# EAGLE design Pcon (EAGLE 7.7.0)
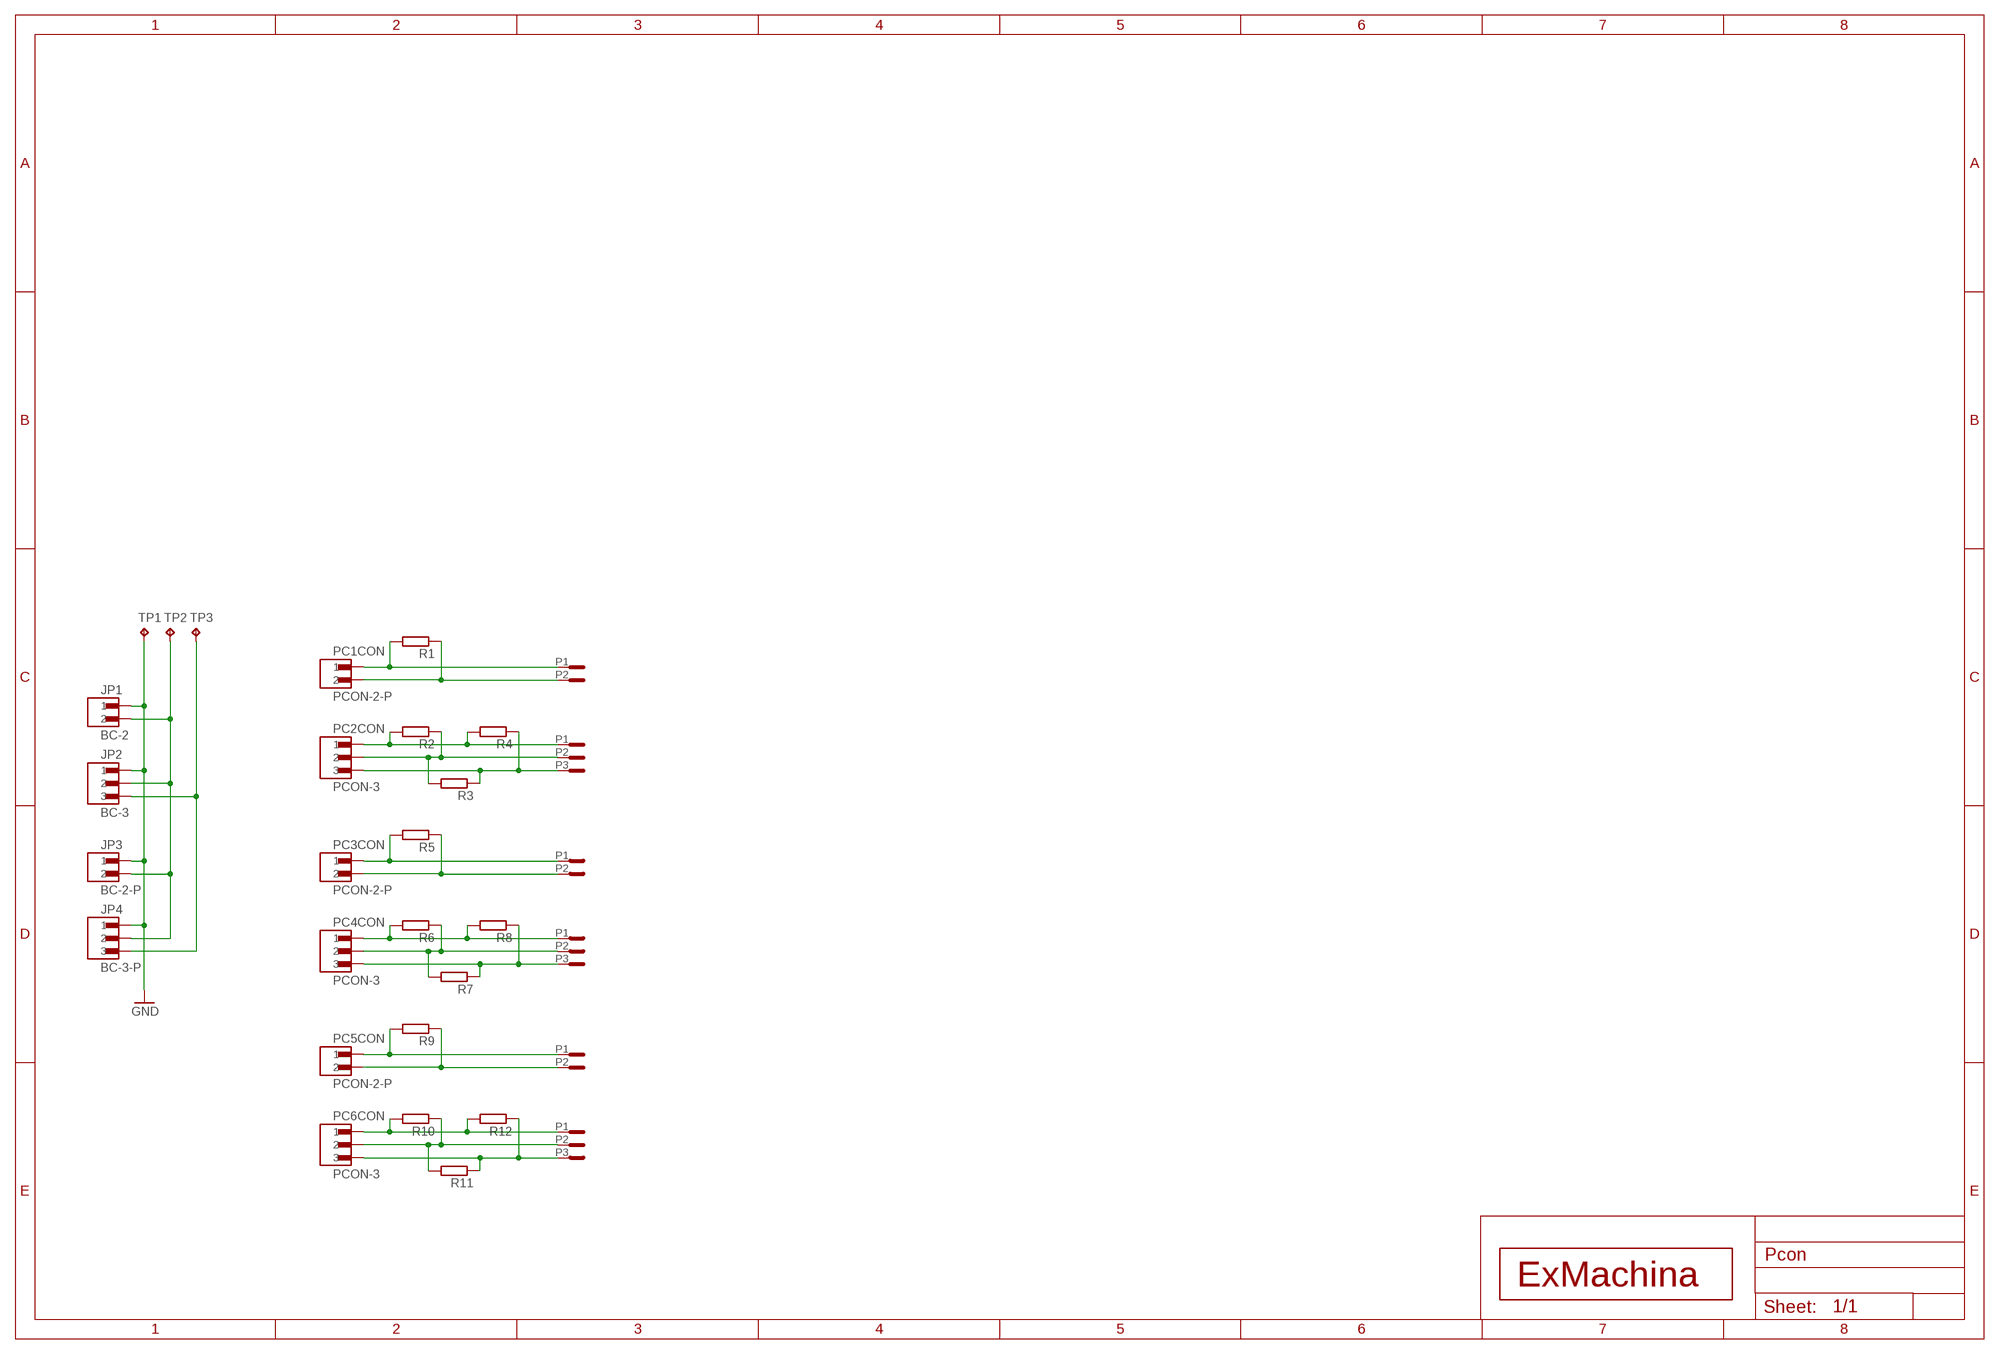
[diagram p0: schematic, sheet 1]

## Parts
JP1  BC-2  [BC-2]
JP2  BC-3  [BC-3]
JP3  BC-2-P  [BC-2-P]
JP4  BC-3-P  [BC-3-P]
PC1  PCON-2-P  [PCON-2]
PC2  PCON-3  [PCON-3]
PC3  PCON-2-P  [PCON-2]
PC4  PCON-3  [PCON-3]
PC5  PCON-2-P  [PCON-2]
PC6  PCON-3  [PCON-3]
R1  R-EU_R0603  [R0603]
R2  R-EU_R0603  [R0603]
R3  R-EU_R0603  [R0603]
R4  R-EU_R0603  [R0603]
R5  R-EU_R0603  [R0603]
R6  R-EU_R0603  [R0603]
R7  R-EU_R0603  [R0603]
R8  R-EU_R0603  [R0603]
R9  R-EU_R0603  [R0603]
R10  R-EU_R0603  [R0603]
R11  R-EU_R0603  [R0603]
R12  R-EU_R0603  [R0603]
TP1  TPB1,27  [B1,27]
TP2  TPB1,27  [B1,27]
TP3  TPB1,27  [B1,27]
U$1  EXMACHINA-LOGO  [EXM-LOGO]

## Nets
GND: JP1.1 JP2.1 JP3.1 JP4.1 TP1.TP
N$1: PC1.2 PC1.P2(P) R1.1
N$2: PC1.1 PC1.P1(P) R1.2
N$3: PC2.3 PC2.P3(P3:P) R3.1 R4.1
N$4: PC2.2 PC2.P2(P2:P) R2.1 R3.2
N$5: PC2.1 PC2.P1(P1:P) R2.2 R4.2
N$6: JP1.2 JP2.2 JP3.2 JP4.2 TP2.TP
N$7: JP2.3 JP4.3 TP3.TP
N$9: PC3.2 PC3.P2(P) R5.1
N$10: PC3.1 PC3.P1(P) R5.2
N$11: PC4.3 PC4.P3(P3:P) R7.1 R8.1
N$12: PC4.2 PC4.P2(P2:P) R6.1 R7.2
N$13: PC4.1 PC4.P1(P1:P) R6.2 R8.2
N$14: PC5.2 PC5.P2(P) R9.1
N$15: PC5.1 PC5.P1(P) R9.2
N$16: PC6.3 PC6.P3(P3:P) R11.1 R12.1
N$17: PC6.2 PC6.P2(P2:P) R10.1 R11.2
N$18: PC6.1 PC6.P1(P1:P) R10.2 R12.2

## Library data of the parts
JP1 JP3 = exmachina:BC-2?
JP2 JP4 = exmachina:BC-3?
PC1 PC3 PC5 = exmachina:PCON-2?
PC2 PC4 PC6 = exmachina:PCON-3?
R1-R12 = rcl:R-EU_: RESISTOR, European symbol
TP1-TP3 = testpad:TP: Test pad
U$1 = exmachina:EXMACHINA-LOGO

## Board
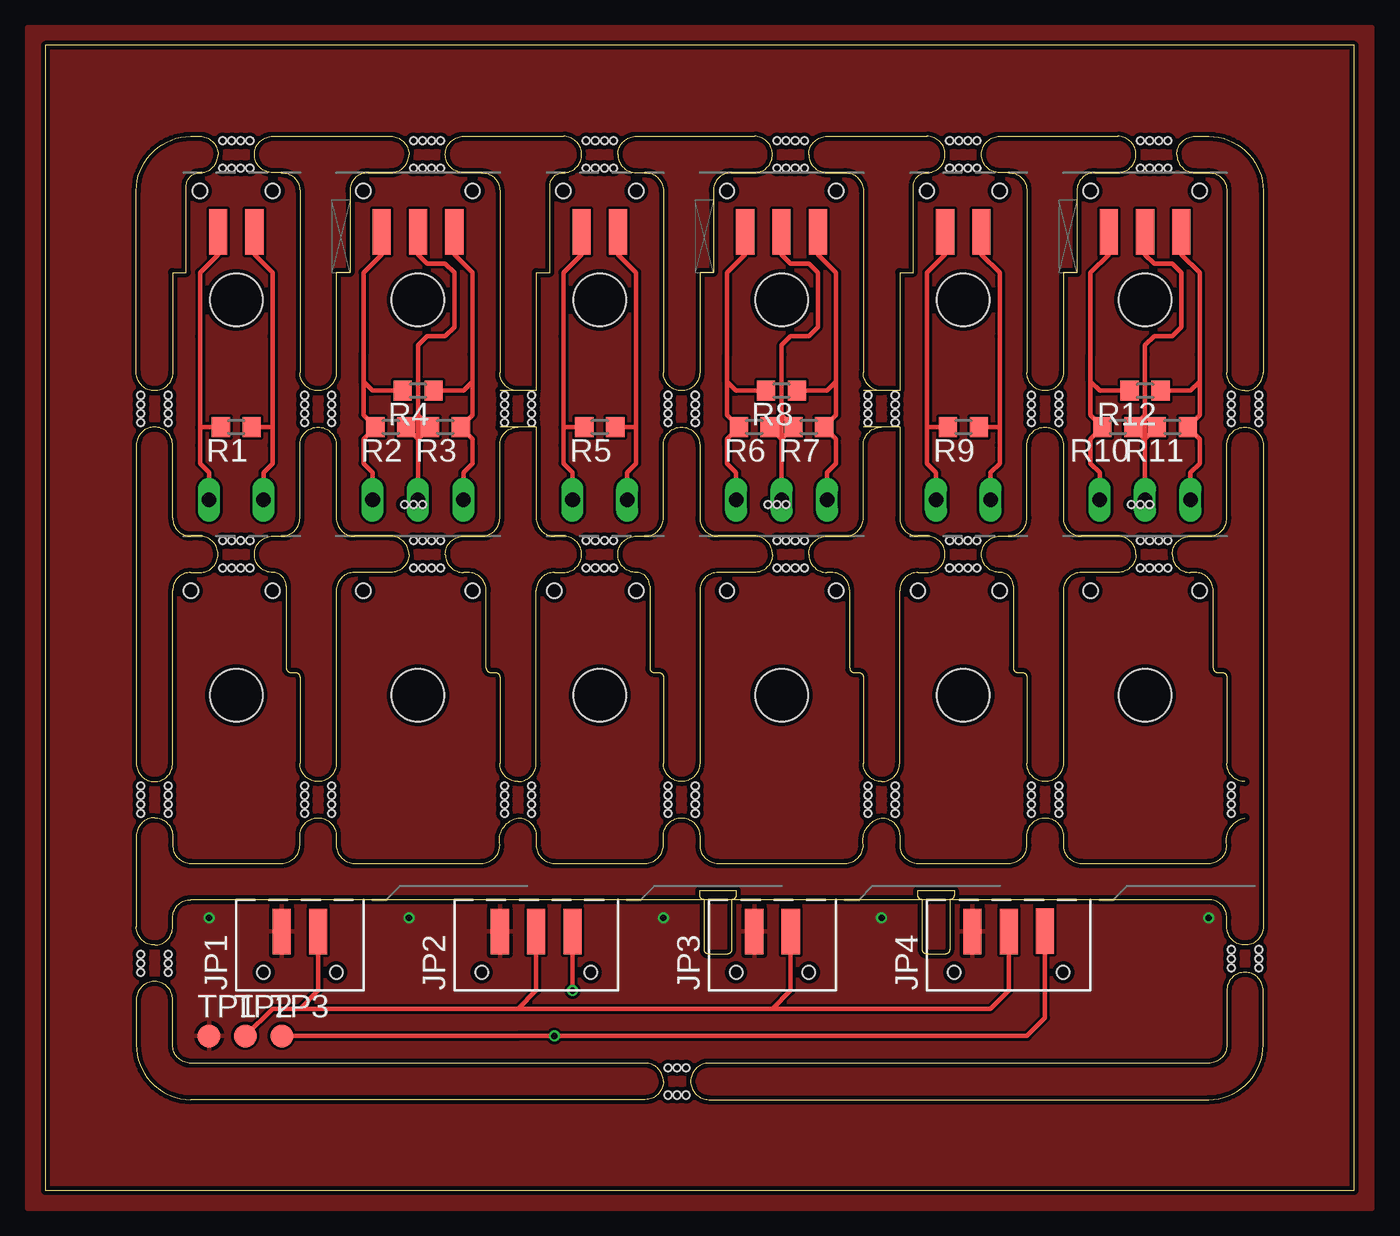
[diagram p1: board, top side]
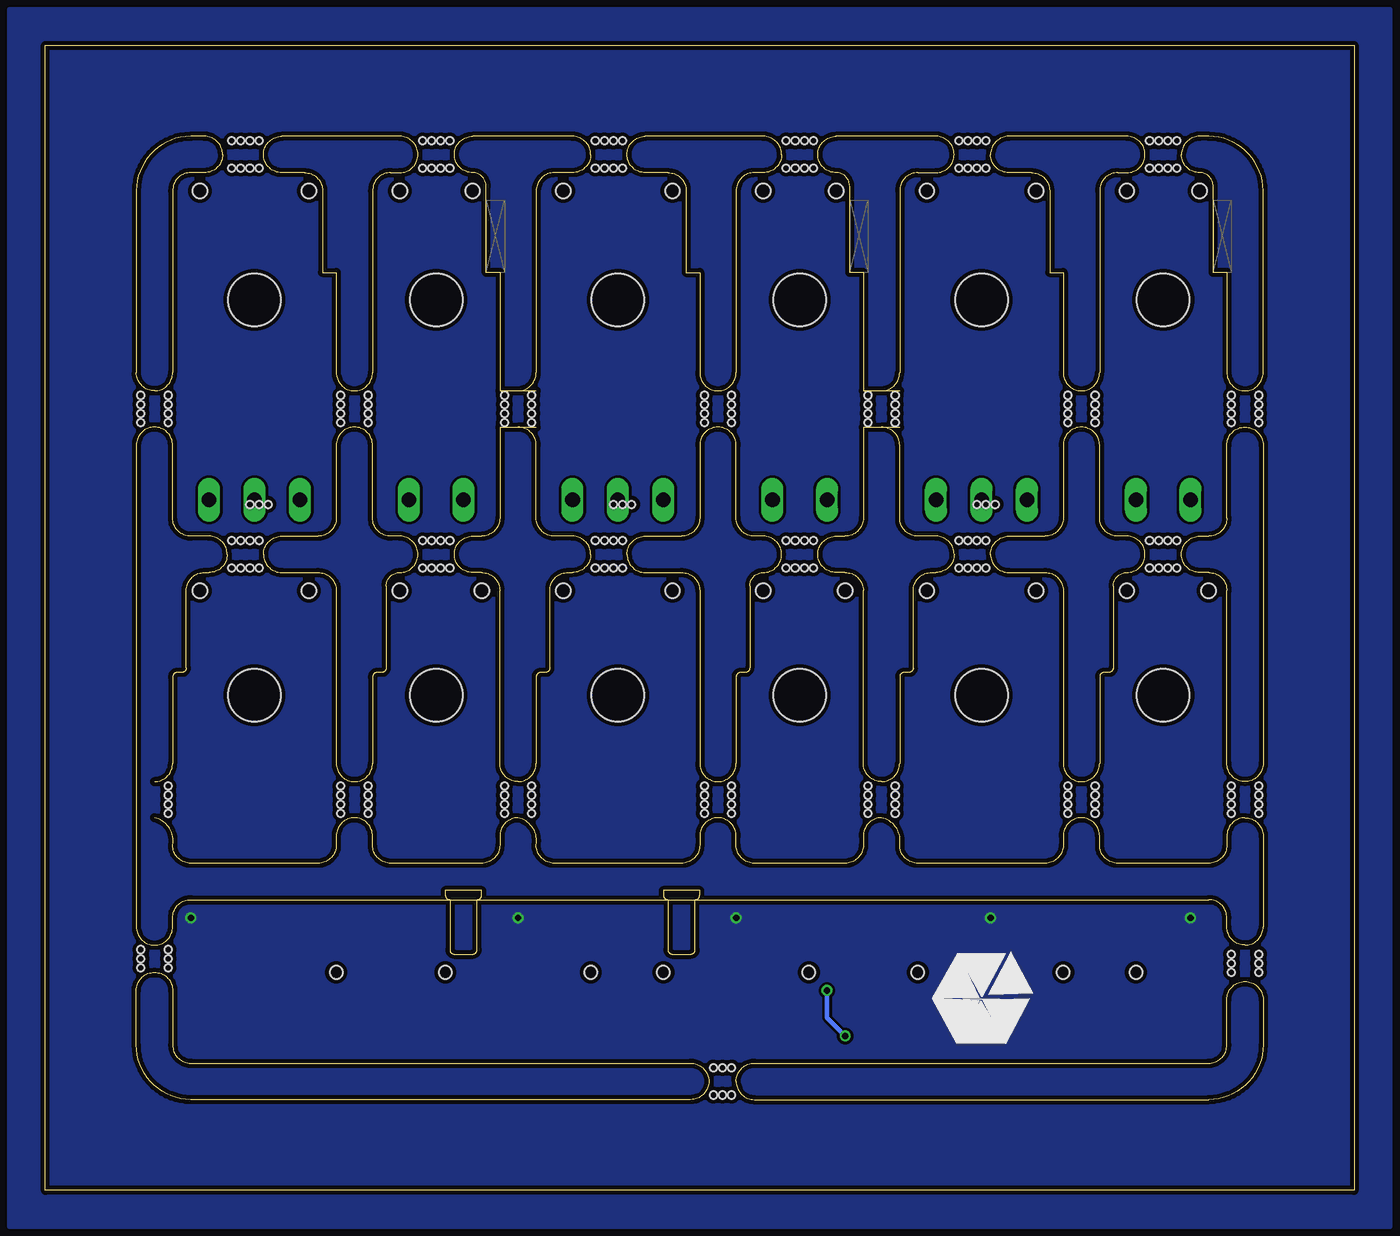
[diagram p2: board, bottom side, seen from below]

Size 72 x 63 mm. Coordinates in mm from the lower left corner, seen from the top.
Outline: 26,42 arc90 25,41 25,37 arc-90 24,36 23,36 arc90 22,35 arc90 23,34 23.25,34 arc-90 24.25,33 24.25,28.75 arc90 24.5,28.5 24.75,28.5 arc-90 25,28.25 25,23.5 arc90 26,22.5 arc90 27,23.5 27,33 arc-90 28,34 28.5,34 arc90 29.5,35 arc90 28.5,36 28,36 arc-90 27,37 27,42 25,42
Outline: 26,44 arc-90 25,45 25,55 arc90 24,56 23,56 arc-90 22,57 arc-90 23,58 28.5,58 arc-90 29.5,57 arc-90 28.5,56 arc90 27.75,55.25 27.75,50.5 27,50.5 27,44 25,44
Outline: 46,42 arc90 45,41 45,37 arc-90 44,36 43,36 arc90 42,35 arc90 43,34 43.25,34 arc-90 44.25,33 44.25,28.75 arc90 44.5,28.5 44.75,28.5 arc-90 45,28.25 45,23.5 arc90 46,22.5 arc90 47,23.5 47,33 arc-90 48,34 48.5,34 arc90 49.5,35 arc90 48.5,36 48,36 arc-90 47,37 47,42 45,42
Outline: 46,44 arc-90 45,45 45,55 arc90 44,56 43,56 arc-90 42,57 arc-90 43,58 48.5,58 arc-90 49.5,57 arc-90 48.5,56 arc90 47.75,55.25 47.75,50.5 47,50.5 47,44 45,44
Outline: 66,20.5 arc90 65,19 arc-90 64,18 57,18 arc-90 56,19 56,19.5 arc90 55,20.5 arc90 54,19.5 54,19 arc-90 53,18 48,18 arc-90 47,19 47,19.5 arc90 46,20.5 arc90 45,19 arc-90 44,18 37,18 arc-90 36,19 36,19.5 arc90 35,20.5 arc90 34,19.5 34,19 arc-90 33,18 28,18 arc-90 27,19 27,19.5 arc90 26,20.5 arc90 25,19 arc-90 24,18 17,18 arc-90 16,19 16,19.5 arc90 15,20.5 arc90 14,19.5 14,19 arc-90 13,18 8,18 arc-90 7,19 7,19.5 arc90 6,20.5 arc90 5,19.5 5,14.5 arc90 6,13.5 arc90 7,14.5 7,15 arc-90 8,16 64,16 arc-90 65,15 65,14.5 arc90 66,13.5 arc90 67,14.5 67,41 arc90 66,42 arc90 65,41 65,37 arc-90 64,36 63,36 arc90 62,35 arc90 63,34 63.25,34 arc-90 64.25,33 64.25,28.75 arc90 64.5,28.5 64.75,28.5 arc-90 65,28.25 65,23.5 arc90 66,22.5
Outline: 0,0 72,0 72,63 0,63 0,0
Outline: 5,23.5 arc90 6,22.5 arc90 7,23.5 7,33 arc-90 8,34 8.5,34 arc90 9.5,35 arc90 8.5,36 8,36 arc-90 7,37 7,41 arc90 6,42 arc90 5,41 5,23.5
Outline: 7.75,50.5 7.75,55.25 arc-90 8.5,56 arc90 9.5,57 arc90 8.5,58 8,58 arc90 5,55 5,45 arc90 6,44 arc90 7,45 7,50.5 7.75,50.5
Outline: 11.5,35 arc-90 12.5,36 13,36 arc90 14,37 14,41 arc-90 15,42 arc-90 16,41 16,37 arc90 17,36 19,36 arc-90 20,35 arc-90 19,34 17,34 arc90 16,33 16,23.5 arc-90 15,22.5 arc-90 14,23.5 14,28.25 arc90 13.75,28.5 13.5,28.5 arc-90 13.25,28.75 13.25,33.25 arc90 12.5,34 arc-90 11.5,35
Outline: 15,44 arc-90 14,45 14,55 arc90 13,56 12.5,56 arc-90 11.5,57 arc-90 12.5,58 19,58 arc-90 20,57 arc-90 19,56 17.75,56 arc90 16.75,55 16.75,50.5 16,50.5 16,45 arc-90 15,44
Outline: 5,10.5 5,8 arc90 8,5 33,5 arc90 34,6 arc90 33,7 8,7 arc-90 7,8 7,10.5 arc90 6,11.5 arc90 5,10.5
Outline: 64,7 36.5,7 arc90 35.5,6 arc90 36.5,5 64,5 arc90 67,8 67,11 arc90 66,12 arc90 65,11 65,8 arc-90 64,7
Outline: 66,44 arc90 67,45 67,55 arc90 64,58 63.25,58 arc90 62.25,57 arc90 63.25,56 64,56 arc-90 65,55 65,45 arc90 66,44
Outline: 37.75,56 39,56 arc90 40,57 arc90 39,58 32.5,58 arc90 31.5,57 arc90 32.5,56 33,56 arc-90 34,55 34,45 arc90 35,44 arc90 36,45 36,50.5 36.75,50.5 36.75,55 arc-90 37.75,56
Outline: 57.75,56 59,56 arc90 60,57 arc90 59,58 52.5,58 arc90 51.5,57 arc90 52.5,56 53,56 arc-90 54,55 54,45 arc90 55,44 arc90 56,45 56,50.5 56.75,50.5 56.75,55 arc-90 57.75,56
Outline: 31.5,35 arc-90 32.5,36 33,36 arc90 34,37 34,41 arc-90 35,42 arc-90 36,41 36,37 arc90 37,36 39,36 arc-90 40,35 arc-90 39,34 37,34 arc90 36,33 36,23.5 arc-90 35,22.5 arc-90 34,23.5 34,28.25 arc90 33.75,28.5 33.5,28.5 arc-90 33.25,28.75 33.25,33.25 arc90 32.5,34 arc-90 31.5,35
Outline: 51.5,35 arc-90 52.5,36 53,36 arc90 54,37 54,41 arc-90 55,42 arc-90 56,41 56,37 arc90 57,36 59,36 arc-90 60,35 arc-90 59,34 57,34 arc90 56,33 56,23.5 arc-90 55,22.5 arc-90 54,23.5 54,28.25 arc90 53.75,28.5 53.5,28.5 arc-90 53.25,28.75 53.25,33.25 arc90 52.5,34 arc-90 51.5,35
Copper layers (1*16): Top 0.018mm / dielectric 1.55mm / Bottom 0.018mm
Design rules "eC_2Layer_PClass6_BaseCopperO18_eCDefault *": minimum track width 0.15mm, minimum drill 0.35mm, track to track 0.15mm, track to pad 0.15mm, pad to pad 0.15mm, via to via 0.15mm, smd to smd 0mil, copper to edge 0.25mm, drill to drill 0.35mm, minimum pad ring 0.175mm, minimum via ring 0.125mm, stop-mask expansion 0mil, vias tented up to drill 0.45mm, thermal gap 0.2mm
Holes 2.9 mm at 10.5,27.25 20.5,27.25 30.5,27.25 40.5,27.25 50.5,27.25 60.5,27.25
Holes 0.8 mm at 17.5,33 23.5,33 12.5,33 8,33 37.5,33 43.5,33 32.5,33 28,33 57.5,33 63.5,33 52.5,33 48,33
Holes 0.4 mm at 5.25,22.25 5.25,21.75 5.25,21.25 5.25,20.75 9.75,56.25 10.25,56.25 10.75,56.25 11.25,56.25 6.75,43.25 6.75,42.75 6.75,42.25 6.75,21.75 6.75,21.25 6.75,20.75 14.25,21.75 14.25,21.25 14.25,20.75 15.75,21.75 15.75,21.25 15.75,20.75 25.25,21.75 25.25,21.25 25.25,20.75 21.75,56.25 21.25,56.25 20.75,56.25 20.25,56.25 25.25,43.25 25.25,42.75 25.25,42.25 19.75,37.75 20.25,37.75 20.75,37.75 14.25,43.25 14.25,42.75 14.25,42.25 15.75,43.25 15.75,42.75 15.75,42.25 6.75,22.25 14.25,22.25 15.75,22.25 25.25,22.25 6.75,43.75 14.25,43.75 15.75,43.75 25.25,43.75 29.75,56.25 30.25,56.25 30.75,56.25 31.25,56.25 26.75,43.25 26.75,42.75 26.75,42.25 26.75,21.75 26.75,21.25 26.75,20.75 34.25,21.75 34.25,21.25 34.25,20.75 35.75,21.75 35.75,21.25 35.75,20.75 45.25,21.75 45.25,21.25 45.25,20.75 41.75,56.25 41.25,56.25 40.75,56.25 40.25,56.25 45.25,43.25 45.25,42.75 45.25,42.25 39.75,37.75 40.25,37.75 40.75,37.75 34.25,43.25 34.25,42.75 34.25,42.25 35.75,43.25 35.75,42.75 35.75,42.25 26.75,22.25 34.25,22.25 35.75,22.25 45.25,22.25 26.75,43.75 34.25,43.75 35.75,43.75 45.25,43.75 49.75,56.25 50.25,56.25 50.75,56.25 51.25,56.25 46.75,43.25 46.75,42.75 46.75,42.25 46.75,21.75 46.75,21.25 46.75,20.75 54.25,21.75 54.25,21.25 54.25,20.75 55.75,21.75 55.75,21.25 55.75,20.75 65.25,21.75 65.25,21.25 65.25,20.75 61.75,56.25 61.25,56.25 60.75,56.25 60.25,56.25 65.25,43.25 65.25,42.75 65.25,42.25 59.75,37.75 60.25,37.75 60.75,37.75 54.25,43.25 54.25,42.75 54.25,42.25 55.75,43.25 55.75,42.75 55.75,42.25 46.75,22.25 54.25,22.25 55.75,22.25 65.25,22.25 46.75,43.75 54.25,43.75 55.75,43.75 65.25,43.75 5.25,43.25 5.25,42.75 5.25,42.25 5.25,43.75 5.25,13 5.25,12.5 5.25,12 6.75,13 6.75,12.5 6.75,12 65.25,13.25 65.25,12.75 65.25,12.25 66.75,13.25 66.75,12.75 66.75,12.25 34.25,5.25 34.75,5.25 35.25,5.25 34.25,6.75 34.75,6.75 35.25,6.75 9.75,57.75 10.25,57.75 10.75,57.75 11.25,57.75 21.75,57.75 21.25,57.75 20.75,57.75 20.25,57.75 29.75,57.75 30.25,57.75 30.75,57.75 31.25,57.75 41.75,57.75 41.25,57.75 40.75,57.75 40.25,57.75 49.75,57.75 50.25,57.75 50.75,57.75 51.25,57.75 61.75,57.75 61.25,57.75 60.75,57.75 60.25,57.75 66.75,43.25 66.75,42.75 66.75,42.25 66.75,43.75 60.75,35.75 61.25,35.75 61.75,35.75 60.25,35.75 60.75,34.25 61.25,34.25 61.75,34.25 60.25,34.25 50.25,35.75 50.75,35.75 51.25,35.75 49.75,35.75 50.25,34.25 50.75,34.25 51.25,34.25 49.75,34.25 40.75,35.75 41.25,35.75 41.75,35.75 40.25,35.75 40.75,34.25 41.25,34.25 41.75,34.25 40.25,34.25 30.25,35.75 30.75,35.75 31.25,35.75 29.75,35.75 30.25,34.25 30.75,34.25 31.25,34.25 29.75,34.25 20.75,35.75 21.25,35.75 21.75,35.75 20.25,35.75 20.75,34.25 21.25,34.25 21.75,34.25 20.25,34.25 10.25,35.75 10.75,35.75 11.25,35.75 9.75,35.75 10.25,34.25 10.75,34.25 11.25,34.25 9.75,34.25

### Footprints (pad centres in the part's own frame; a part is rotated, then mirrored left to right if it is on the bottom)
BC-2 = smd 1 x 2.5: 1 -1,-0.75; 2 1,-0.75 | hole 0.7: -2,-3; 2,-3
BC-3 = smd 1 x 2.5: 1 -2,-0.75; 2 0,-0.75; 3 2,-0.75 | hole 0.7: -3,-3; 3,-3
BC-2-P = smd 1 x 2.5: 1 -1,-0.75; 2 1,-0.75 | hole 0.7: -2,-3; 2,-3
BC-3-P = smd 1 x 2.5: 1 -2,-0.75; 2 0,-0.75; 3 1.98,-0.73 | hole 0.7: -3,-3; 3,-3
PCON-2 = smd 1 x 2.5: 1 -1,-2.25; 2 1,-2.25 | drill 0.8 long: P1 -1.5,-17; P2 1.5,-17 | hole 0.8: 2,0; -2,0 | hole 2.9: 0,-6
PCON-3 = smd 1 x 2.5: 1 -2,-2.25; 2 0,-2.25; 3 2,-2.25 | drill 0.8 long: P1 -2.5,-17; P2 0,-17; P3 2.5,-17 | hole 0.8: 3,0; -3,0 | hole 2.9: 0,-6
R0603 = smd 1 x 1.1: 1 -0.85,0; 2 0.85,0
B1,27 = smd 1.27 x 1.27: TP 0,0

### Placement (x,y rotation side)
JP1  14,15 0 top
JP2  27,15 0 top
JP3  40,15 0 top
JP4  53,15 0 top
PC1  10.5,55 0 top
PC2  20.5,55 0 top
PC3  30.5,55 0 top
PC4  40.5,55 0 top
PC5  50.5,55 0 top
PC6  60.5,55 0 top
R1  10.5,42 180 top
R2  19,42 180 top
R3  22,42 180 top
R4  20.5,44 180 top
R5  30.5,42 180 top
R6  39,42 180 top
R7  42,42 180 top
R8  40.5,44 180 top
R9  50.5,42 180 top
R10  59,42 180 top
R11  62,42 180 top
R12  60.5,44 180 top
TP1  9,8.5 0 top
TP2  11,8.5 0 top
TP3  13,8.5 0 top
U$1  20.51,10.54 0 bottom

### Tracks (layer width: path | path; a pad name or v marks a point on that pad's centre or on a via)
GND  (via drill 0.35)
  other vias: 9,15 20,15 34,15 46,15 64,15
  pour Top: -1,-1 -1,64 73,64 73,-1
  pour Bottom: 74,-2 74,65 -2,65 -2,-2
N$1
  Top 0.254: 12.5,47 12.5,42 | 12.5,42 12.5,41 | R1.1 12.5,42
N$2
  Top 0.254: 8.5,47 8.5,42 | 8.5,42 8.5,41 | R1.2 8.5,42
N$3
  Top 0.254: 23.5,44.5 23.5,42.65 R3.1 23.5,41.35 23.5,41 | R4.1 23,44 23.5,44.5 | 23.5,46 23.5,44.5
N$4
  Top 0.254: 20.5,42.65 R2.1 20.5,41.35 | 20.5,42.65 R3.2 20.5,41.35 | 20.5,41.35 20.5,41 | 20.5,42.65 20.5,41.35 | 20.5,42.65 20.5,46
N$5
  Top 0.254: 17.5,41 17.5,41.35 R2.2 17.5,42.65 17.5,44.5 | R4.2 18,44 17.5,44.5 | 17.5,44.5 17.5,46
N$6
  Top 0.254: TP2.TP 12.5,10 14,10 | 14,10 26,10 | 26,10 40,10 | 40,10 52,10 53,11 JP4.2 | JP3.2 41,11 40,10 | JP2.2 27,11 26,10 | JP1.2 15,11 14,10
N$7  (via drill 0.35)
  Top 0.254: TP3.TP 26,8.5 v28,8.5 54,8.5 55,9.5 55,14.25 JP4.3 | JP2.3 v29,11
  Bottom 0.254: v29,11 29,9.5 v28,8.5
N$8
  pour Top: 18.25,23.5 22.5,23.5 arc-90 23.5,22.5 23.5,21.5 arc-90 22.5,20.5 18.25,20.5 arc-90 17.5,21.25 17.5,22.75 arc-90
  pour Top: 8.25,23.5 12.5,23.5 arc-90 13.5,22.5 13.5,21.5 arc-90 12.5,20.5 8.25,20.5 arc-90 7.5,21.25 7.5,22.75 arc-90
N$9
  Top 0.254: 32.5,47 32.5,42 | 32.5,42 32.5,41 | R5.1 32.5,42
N$10
  Top 0.254: 28.5,47 28.5,42 | 28.5,42 28.5,41 | R5.2 28.5,42
N$11
  Top 0.254: 43.5,44.5 43.5,42.65 R7.1 43.5,41.35 43.5,41 | R8.1 43,44 43.5,44.5 | 43.5,46 43.5,44.5
N$12
  Top 0.254: 40.5,42.65 R6.1 40.5,41.35 | 40.5,42.65 R7.2 40.5,41.35 | 40.5,41.35 40.5,41 | 40.5,42.65 40.5,41.35 | 40.5,42.65 40.5,46
N$13
  Top 0.254: 37.5,41 37.5,41.35 R6.2 37.5,42.65 37.5,44.5 | R8.2 38,44 37.5,44.5 | 37.5,44.5 37.5,46
N$14
  Top 0.254: 52.5,47 52.5,42 | 52.5,42 52.5,41 | R9.1 52.5,42
N$15
  Top 0.254: 48.5,47 48.5,42 | 48.5,42 48.5,41 | R9.2 48.5,42
N$16
  Top 0.254: 63.5,44.5 63.5,42.65 R11.1 63.5,41.35 63.5,41 | R12.1 63,44 63.5,44.5 | 63.5,46 63.5,44.5
N$17
  Top 0.254: 60.5,42.65 R10.1 60.5,41.35 | 60.5,42.65 R11.2 60.5,41.35 | 60.5,41.35 60.5,41 | 60.5,42.65 60.5,41.35 | 60.5,42.65 60.5,46
N$18
  Top 0.254: 57.5,41 57.5,41.35 R10.2 57.5,42.65 57.5,44.5 | R12.2 58,44 57.5,44.5 | 57.5,44.5 57.5,46
N$24
  pour Top: 38.25,23.5 42.5,23.5 arc-90 43.5,22.5 43.5,21.5 arc-90 42.5,20.5 38.25,20.5 arc-90 37.5,21.25 37.5,22.75 arc-90
  pour Top: 28.25,23.5 32.5,23.5 arc-90 33.5,22.5 33.5,21.5 arc-90 32.5,20.5 28.25,20.5 arc-90 27.5,21.25 27.5,22.75 arc-90
N$30
  pour Top: 58.25,23.5 62.5,23.5 arc-90 63.5,22.5 63.5,21.5 arc-90 62.5,20.5 58.25,20.5 arc-90 57.5,21.25 57.5,22.75 arc-90
  pour Top: 48.25,23.5 52.5,23.5 arc-90 53.5,22.5 53.5,21.5 arc-90 52.5,20.5 48.25,20.5 arc-90 47.5,21.25 47.5,22.75 arc-90